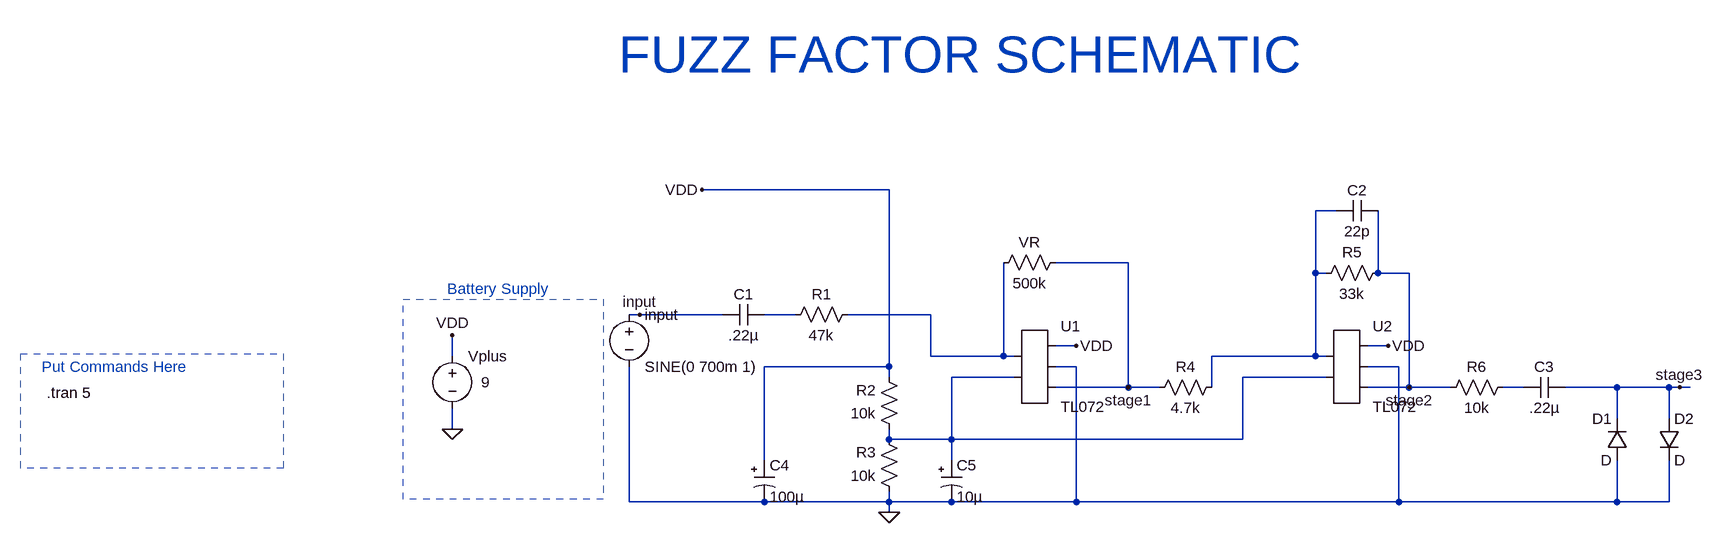
[diagram p0: schematic finalProjSimulationV2.asc]
finalProjSimulationV2.asc, the LTspice schematic file:
Version 4
SHEET 1 3628 760
WIRE 1232 192 944 192
WIRE 1920 224 1888 224
WIRE 1600 304 1488 304
WIRE 1888 320 1888 224
WIRE 1904 320 1888 320
WIRE 1984 320 1984 224
WIRE 2032 320 1984 320
WIRE 848 384 832 384
WIRE 976 384 848 384
WIRE 1088 384 1040 384
WIRE 1296 384 1168 384
WIRE 1520 432 1488 432
WIRE 2000 432 1968 432
WIRE 560 448 560 416
WIRE 1296 448 1296 384
WIRE 1408 448 1408 304
WIRE 1408 448 1296 448
WIRE 1424 448 1408 448
WIRE 1888 448 1888 320
WIRE 1888 448 1728 448
WIRE 1904 448 1888 448
WIRE 1232 464 1232 192
WIRE 1232 464 1040 464
WIRE 1520 464 1488 464
WIRE 2016 464 1968 464
WIRE 1232 480 1232 464
WIRE 1424 480 1328 480
WIRE 1904 480 1776 480
WIRE 1600 496 1600 304
WIRE 1600 496 1488 496
WIRE 1648 496 1600 496
WIRE 1728 496 1728 448
WIRE 2032 496 2032 320
WIRE 2032 496 1968 496
WIRE 2096 496 2032 496
WIRE 2208 496 2176 496
WIRE 2352 496 2272 496
WIRE 2432 496 2352 496
WIRE 2448 496 2432 496
WIRE 2464 496 2448 496
WIRE 2352 544 2352 496
WIRE 2432 544 2432 496
WIRE 560 560 560 528
WIRE 1232 576 1232 560
WIRE 1328 576 1328 480
WIRE 1328 576 1232 576
WIRE 1776 576 1776 480
WIRE 1776 576 1328 576
WIRE 1040 608 1040 464
WIRE 1328 608 1328 576
WIRE 832 672 832 464
WIRE 1040 672 832 672
WIRE 1232 672 1232 656
WIRE 1232 672 1040 672
WIRE 1328 672 1232 672
WIRE 1520 672 1520 464
WIRE 1520 672 1328 672
WIRE 2016 672 2016 464
WIRE 2016 672 1520 672
WIRE 2352 672 2352 608
WIRE 2352 672 2016 672
WIRE 2432 672 2432 608
WIRE 2432 672 2352 672
WIRE 1232 688 1232 672
FLAG 560 416 VDD
FLAG 944 192 VDD
FLAG 1232 688 0
FLAG 848 384 input
FLAG 560 560 0
FLAG 1520 432 VDD
FLAG 2000 432 VDD
FLAG 1600 496 stage1
FLAG 2032 496 stage2
FLAG 2448 496 stage3
SYMBOL voltage 560 432 R0
WINDOW 123 0 0 Left 2
WINDOW 39 0 0 Left 2
WINDOW 3 44 56 Left 2
SYMATTR Value 9
SYMATTR InstName Vplus
SYMBOL Res 1184 368 R90
WINDOW 0 0 56 VBottom 2
WINDOW 3 32 56 VTop 2
SYMATTR InstName R1
SYMATTR Value 47k
SYMBOL Res 1248 576 R180
WINDOW 0 36 76 Left 2
WINDOW 3 36 40 Left 2
SYMATTR InstName R2
SYMATTR Value 10k
SYMBOL Res 1248 672 R180
WINDOW 0 36 76 Left 2
WINDOW 3 36 40 Left 2
SYMATTR InstName R3
SYMATTR Value 10k
SYMBOL Cap 1040 368 R90
WINDOW 0 0 32 VBottom 2
WINDOW 3 32 32 VTop 2
SYMATTR InstName C1
SYMATTR Value .22µ
SYMBOL Voltage 832 368 R0
WINDOW 123 0 0 Left 0
WINDOW 39 0 0 Left 0
SYMATTR InstName input
SYMATTR Value SINE(0 700m 1)
SYMBOL AutoGenerated\\TL072 1456 464 R0
SYMATTR InstName U1
SYMBOL res 1504 288 R90
WINDOW 0 0 56 VBottom 2
WINDOW 3 32 56 VTop 2
SYMATTR InstName VR
SYMATTR Value 500k
SYMBOL polcap 1024 608 R0
SYMATTR InstName C4
SYMATTR Value 100µ
SYMBOL polcap 1312 608 R0
SYMATTR InstName C5
SYMATTR Value 10µ
SYMBOL res 1744 480 R90
WINDOW 0 0 56 VBottom 2
WINDOW 3 32 56 VTop 2
SYMATTR InstName R4
SYMATTR Value 4.7k
SYMBOL AutoGenerated\\TL072 1936 464 R0
SYMATTR InstName U2
SYMBOL res 2000 304 R90
WINDOW 0 0 56 VBottom 2
WINDOW 3 32 56 VTop 2
SYMATTR InstName R5
SYMATTR Value 33k
SYMBOL cap 1984 208 R90
WINDOW 0 0 32 VBottom 2
WINDOW 3 32 32 VTop 2
SYMATTR InstName C2
SYMATTR Value 22p
SYMBOL res 2192 480 R90
WINDOW 0 0 56 VBottom 2
WINDOW 3 32 56 VTop 2
SYMATTR InstName R6
SYMATTR Value 10k
SYMBOL cap 2272 480 R90
WINDOW 0 0 32 VBottom 2
WINDOW 3 32 32 VTop 2
SYMATTR InstName C3
SYMATTR Value .22µ
SYMBOL diode 2368 608 R180
WINDOW 0 24 64 Left 2
WINDOW 3 24 0 Left 2
SYMATTR InstName D1
SYMBOL diode 2416 544 R0
SYMATTR InstName D2
TEXT -64 504 Left 2 !.tran 5
TEXT -72 464 Left 2 ;Put Commands Here
TEXT 552 344 Left 2 ;Battery Supply
TEXT 816 -16 Left 6 ;FUZZ FACTOR SCHEMATIC
RECTANGLE Normal 484 360 792 668 2
RECTANGLE Normal -104 444 300 620 2

The netlist it stands for:
* finalProjSimulationV2.asc
Vplus VDD 0 9
R1 N003 N002 47k
R2 N004 VDD 10k
R3 0 N004 10k
C1 N002 input .22µ
V§input input 0 SINE(0 700m 1)
* U1: TL072 (symbol AutoGenerated\TL072 not available, pins judged from their places): pin1=N003 pin2=N004 pin3=VDD pin4=0 pin5=stage1
R§VR stage1 N003 500k
C4 VDD 0 100µ
C5 N004 0 10µ
R4 N001 stage1 4.7k
* U2: TL072 (symbol AutoGenerated\TL072 not available, pins judged from their places): pin1=N001 pin2=N004 pin3=VDD pin4=0 pin5=stage2
R5 stage2 N001 33k
C2 stage2 N001 22p
R6 N005 stage2 10k
C3 stage3 N005 .22µ
D1 0 stage3 D
D2 stage3 0 D
.model D D
.lib standard.dio
.tran 5
* Put Commands Here
* Battery Supply
* FUZZ FACTOR SCHEMATIC
.backanno
.end